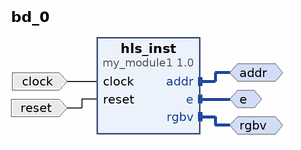
[diagram p0: block diagram of the top level]
# Vivado block design bd_0, xc7a100tcsg324-1, Vivado 2020.1
create_bd_design bd_0

create_bd_intf_port -mode Master -vlnv xilinx.com:interface:acc_fifo_write_rtl:1.0 addr
create_bd_intf_port -mode Master -vlnv xilinx.com:interface:acc_fifo_read_rtl:1.0 e
create_bd_intf_port -mode Master -vlnv xilinx.com:interface:acc_fifo_write_rtl:1.0 rgbv
create_bd_port -dir I -type clk clock
set_property -dict {CONFIG.FREQ_HZ 100000000.0} [get_bd_ports clock]
create_bd_port -dir I -type rst reset

create_bd_cell -type ip -vlnv xilinx.com:hls:my_module1:1.0 hls_inst

# ---- connections ----

connect_bd_intf_net [get_bd_intf_ports addr] [get_bd_intf_pins hls_inst/addr]
connect_bd_intf_net [get_bd_intf_ports e] [get_bd_intf_pins hls_inst/e]
connect_bd_intf_net [get_bd_intf_ports rgbv] [get_bd_intf_pins hls_inst/rgbv]
connect_bd_net -net clock_0_1 [get_bd_ports clock] [get_bd_pins hls_inst/clock]
connect_bd_net -net reset_0_1 [get_bd_ports reset] [get_bd_pins hls_inst/reset]

validate_bd_design
save_bd_design
